# EasyEDA schematic RFFI_pwrCtrl_Integrated_2021-05-07.json

## Sheets
1 Analog Signals: TITLE: Аналоговые сигналы; REV: 1.0; Date: 2021-04-26; Sheet: 1/1; Drawn By: Kirill Ivanychev; Company: NNTU
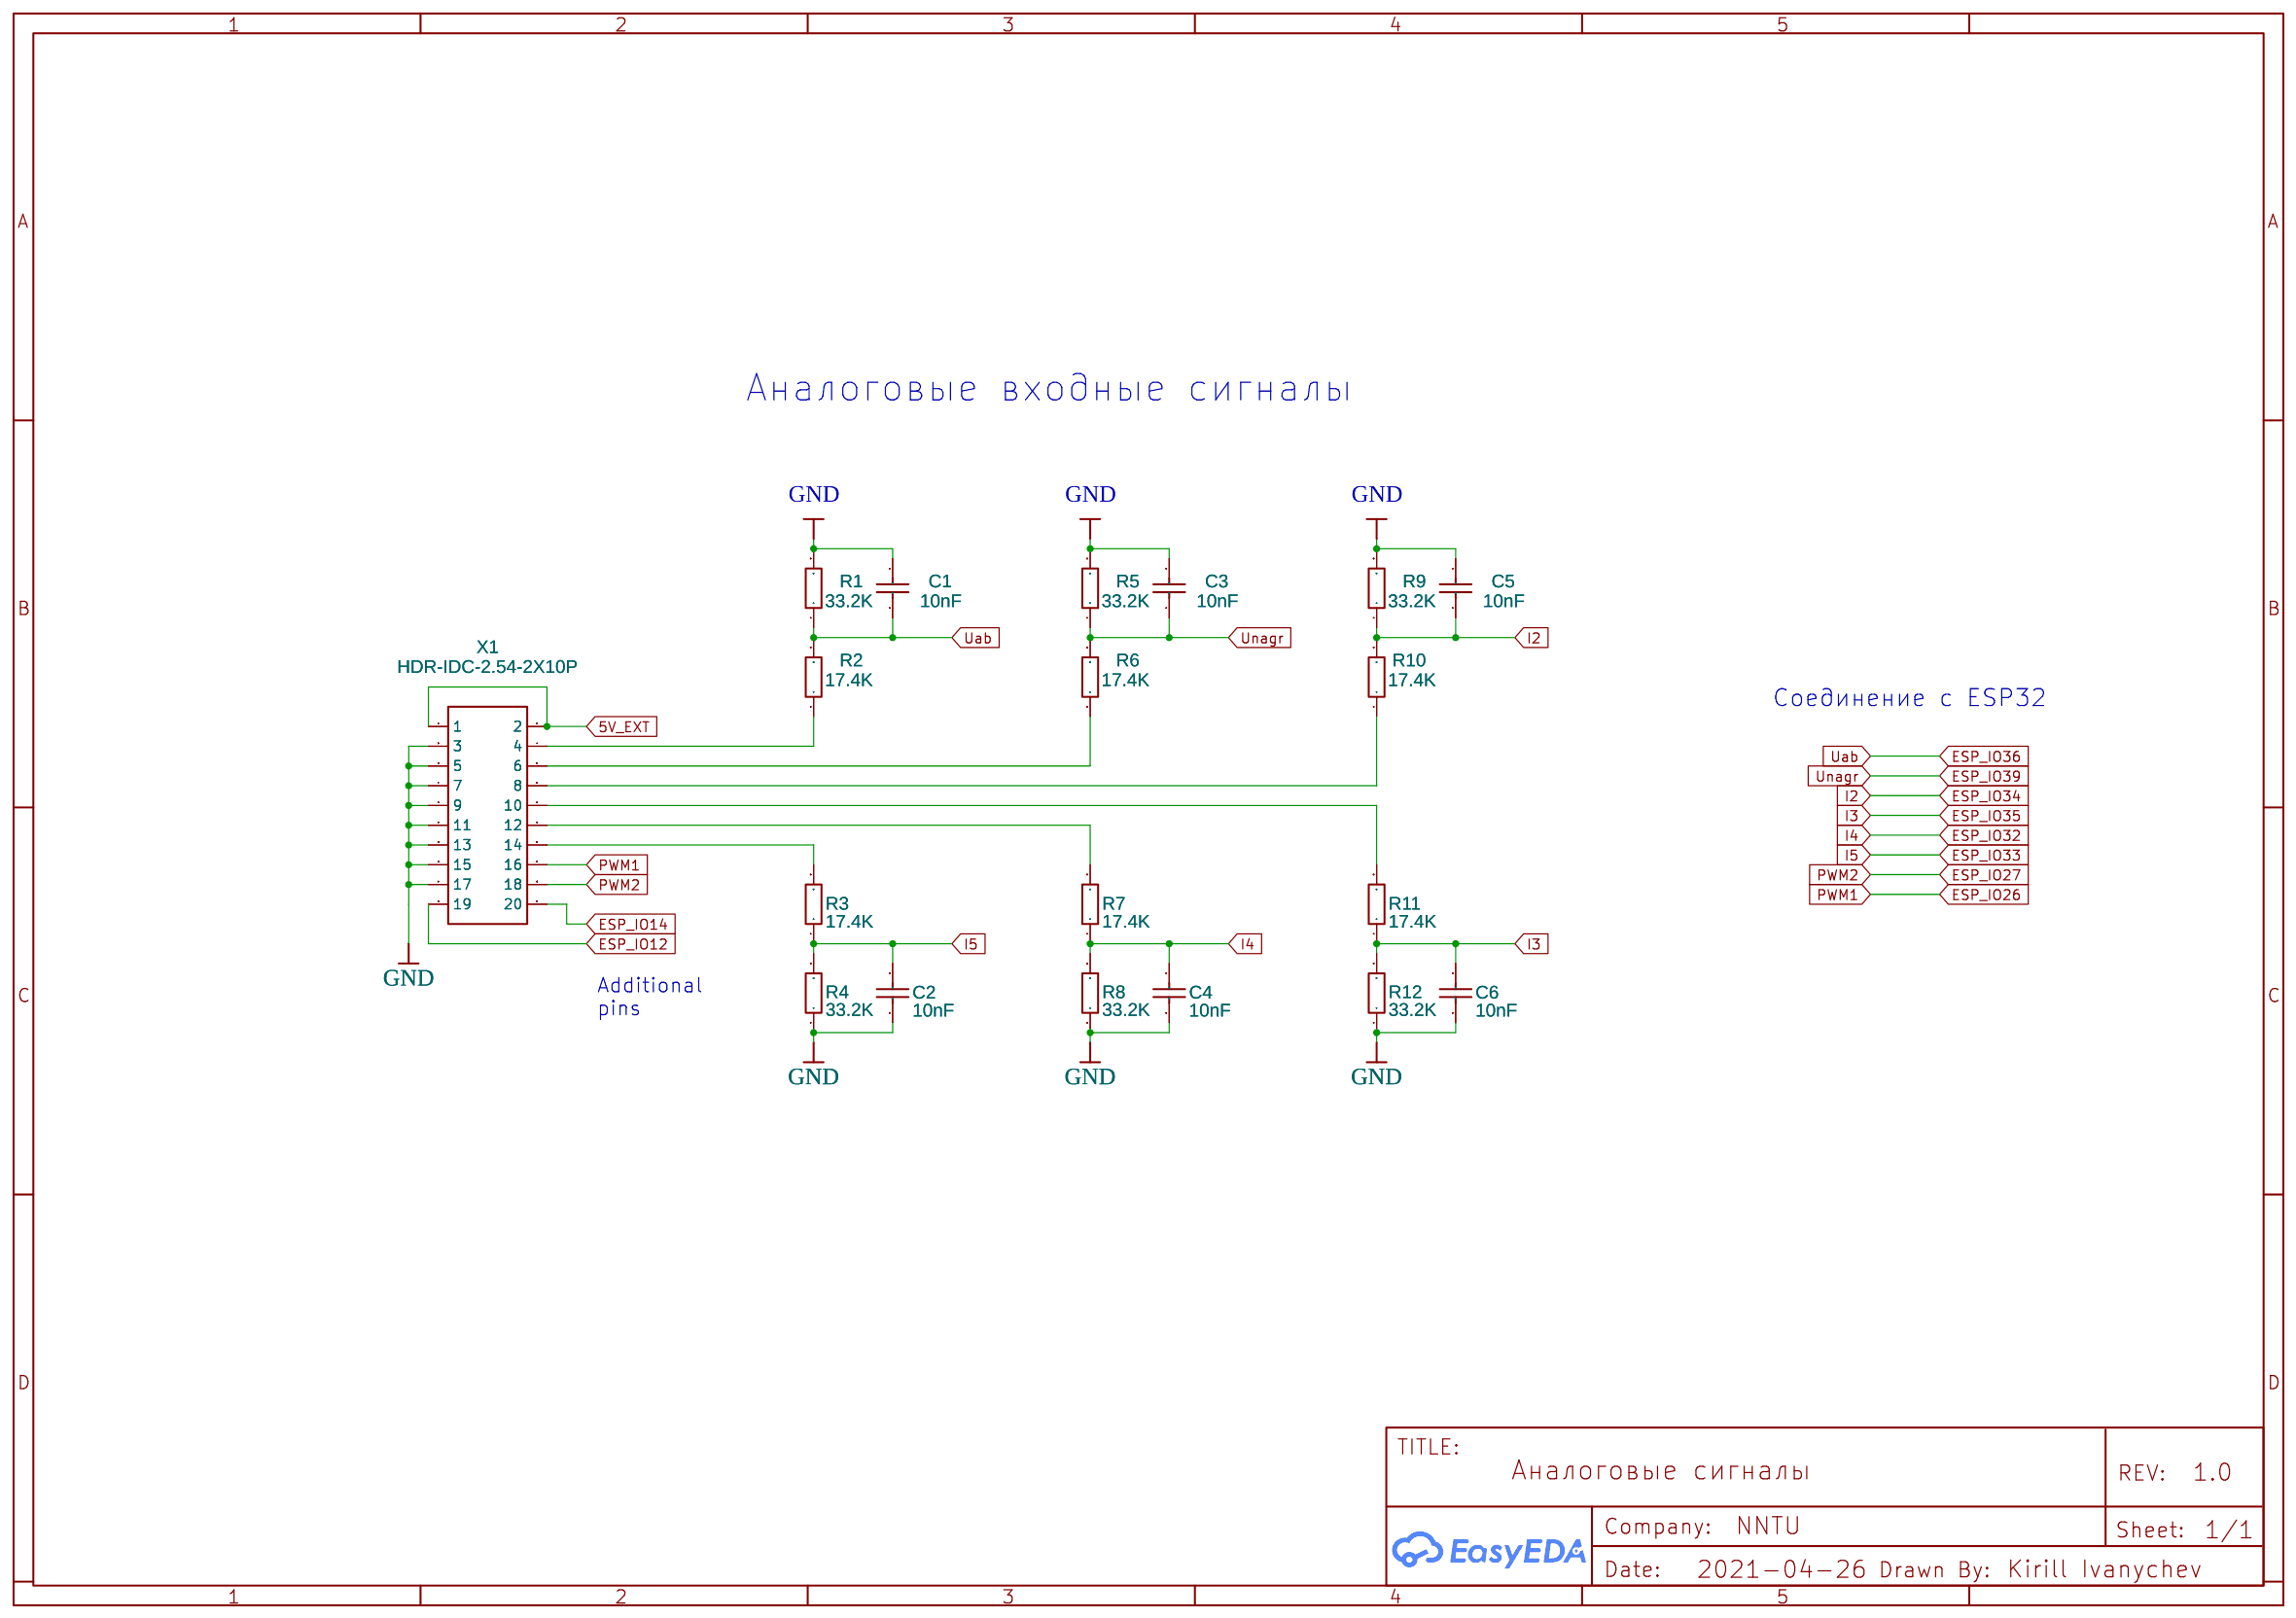
[diagram p0: Analog Signals]
2 ESP32 module: TITLE: ESP32 module; Date: 2021-05-07
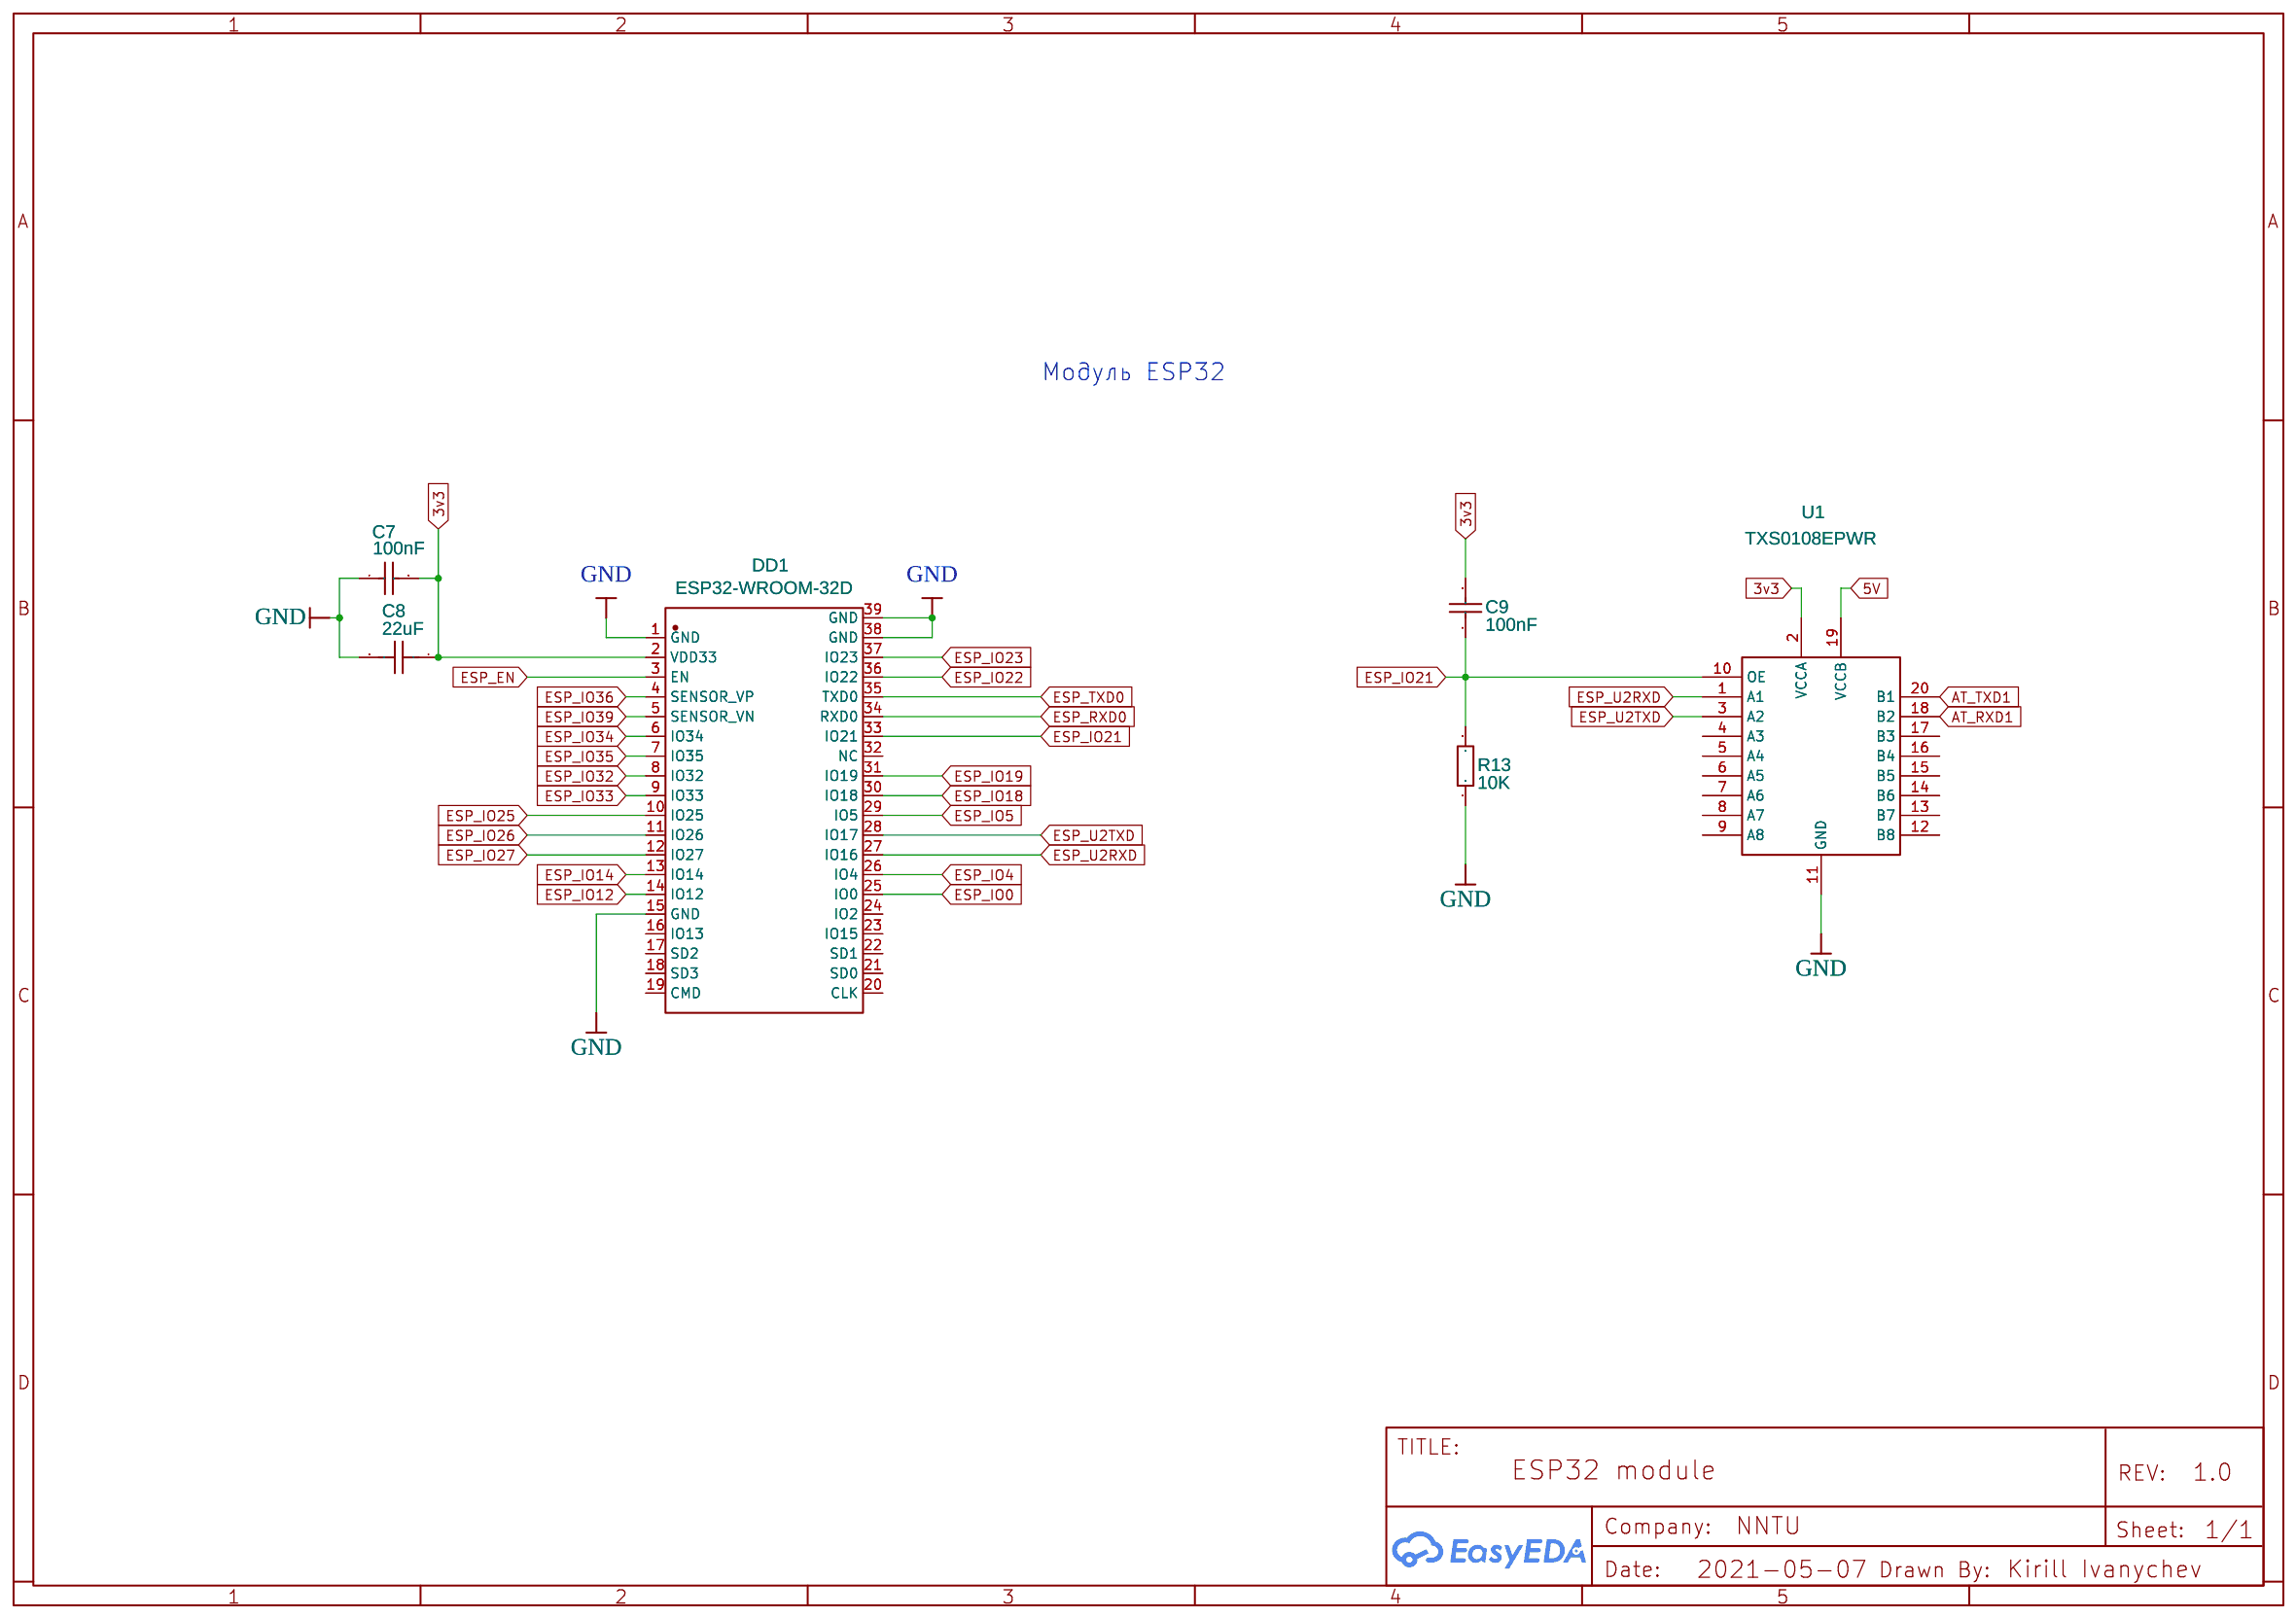
[diagram p1: ESP32 module]
3 USB: TITLE: USB; Date: 2021-04-14
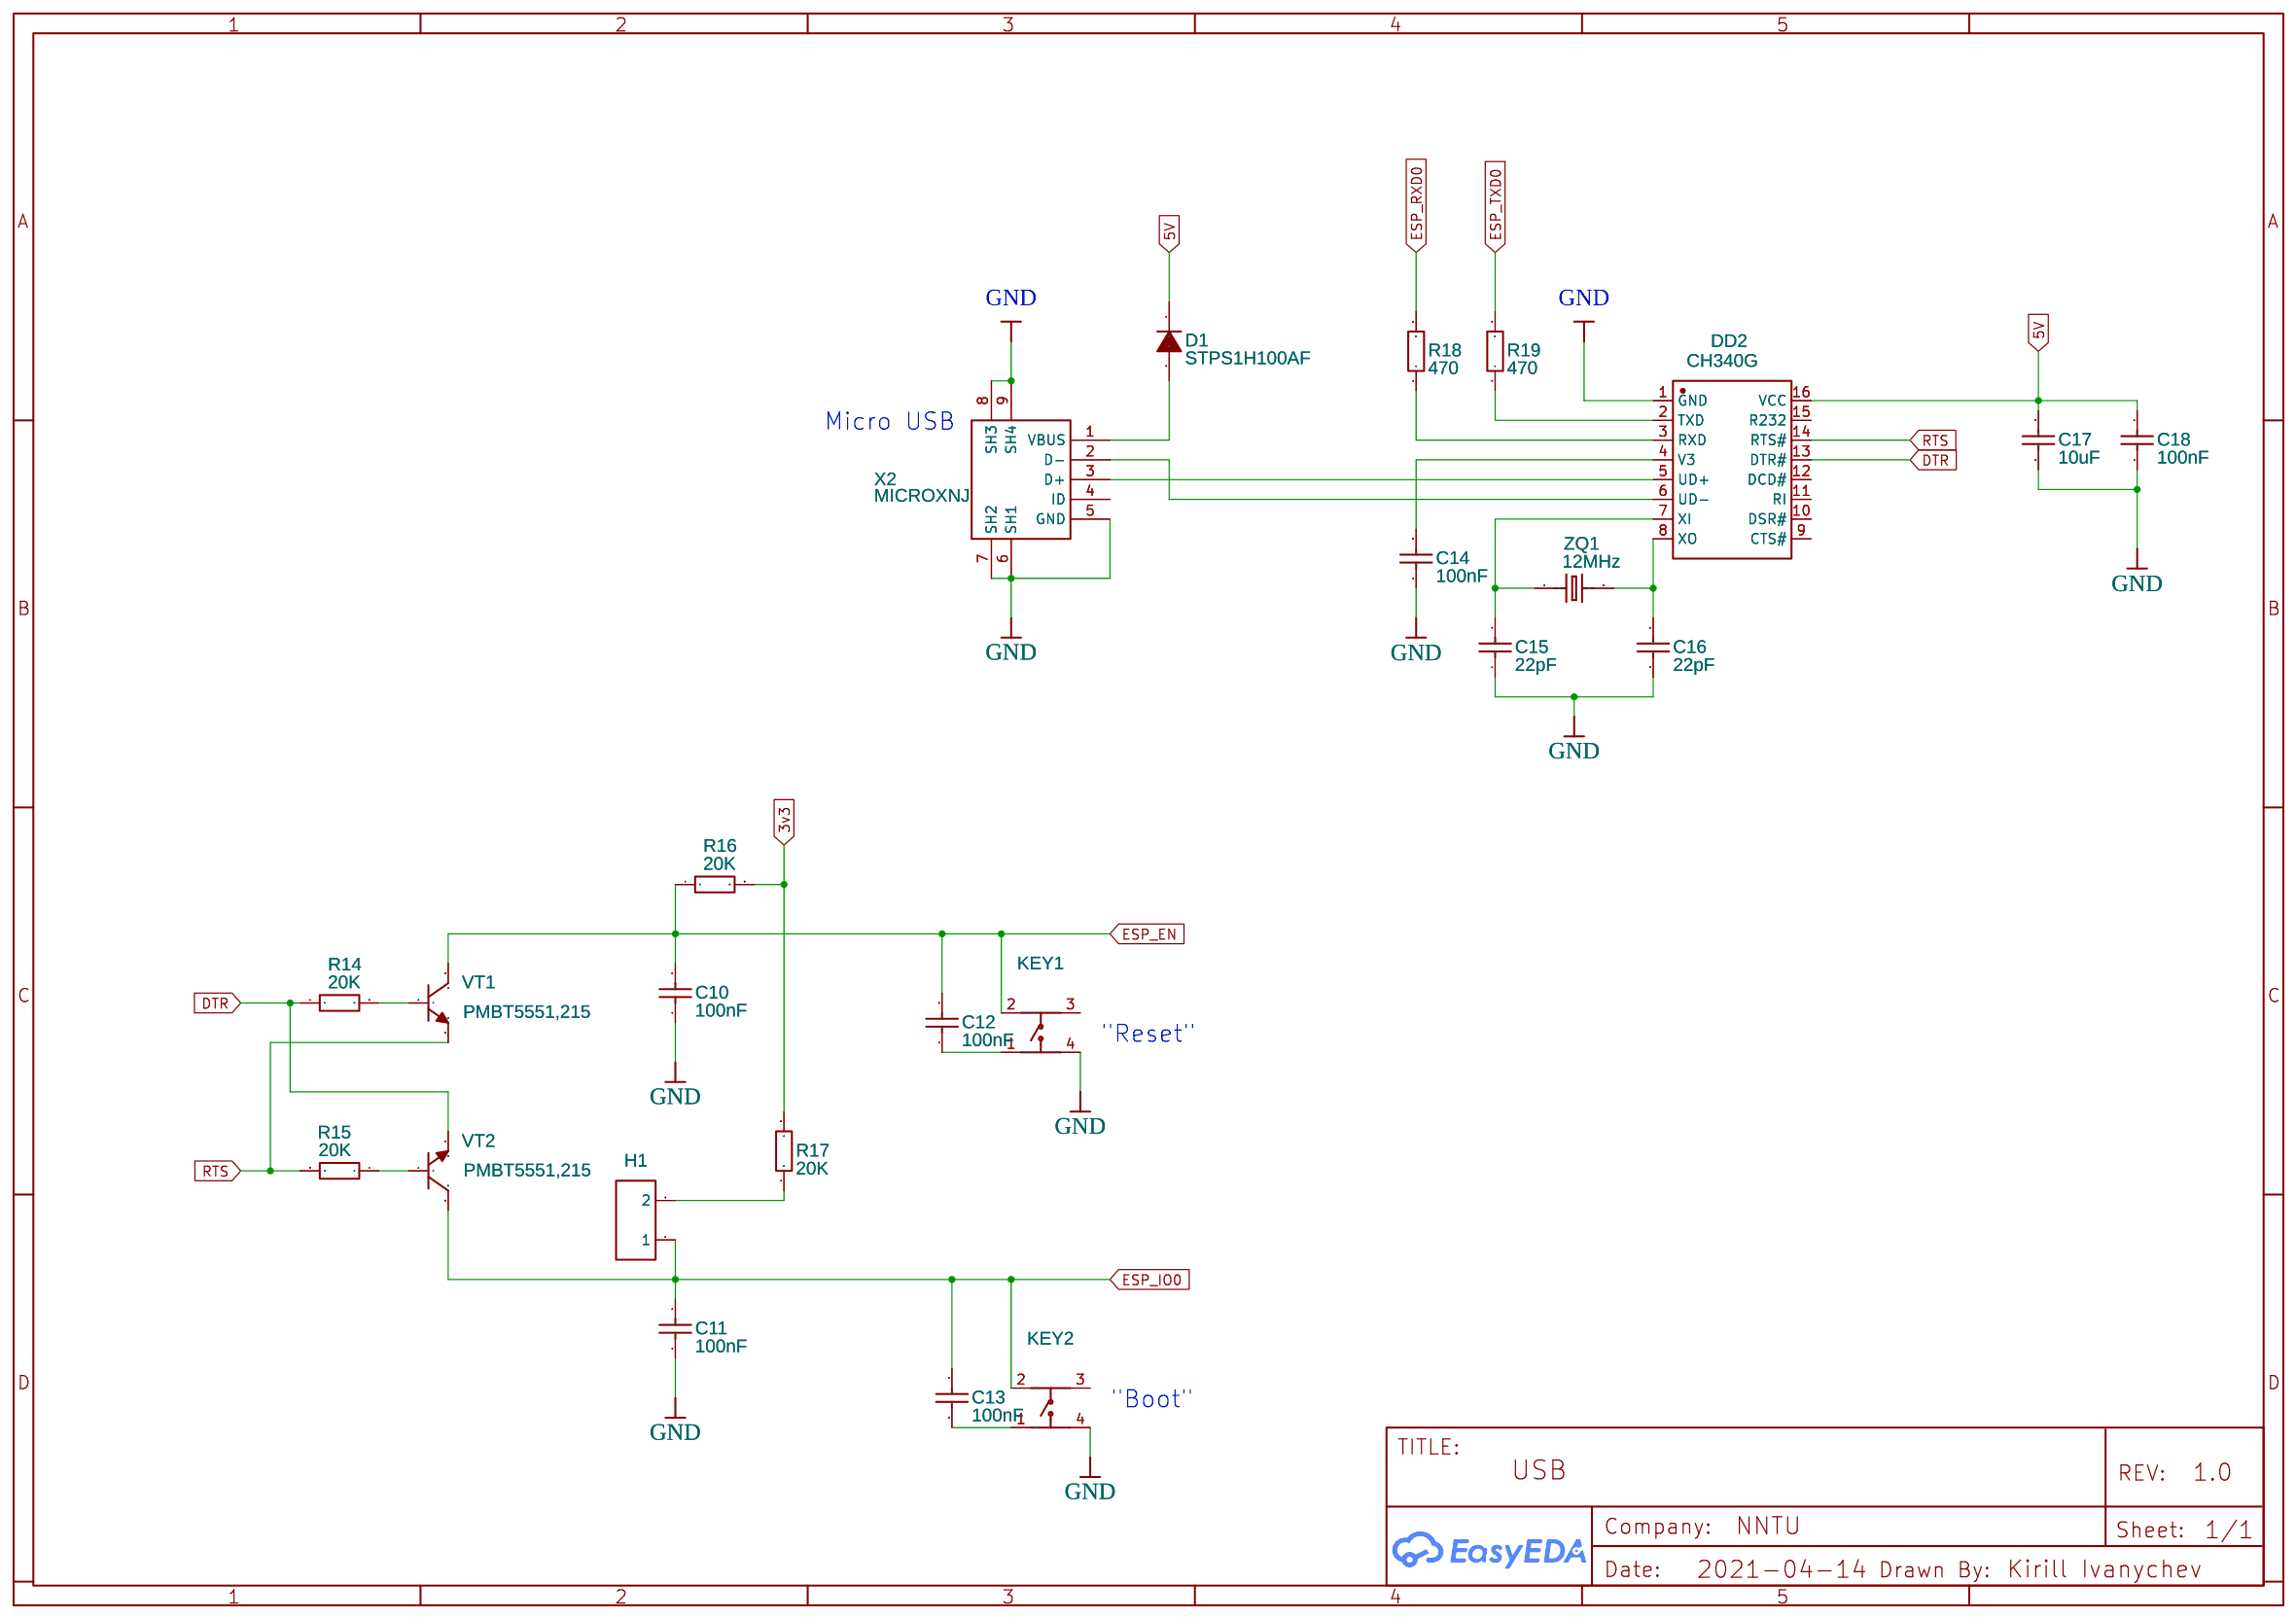
[diagram p2: USB]
4 Power: TITLE: Питание; Date: 2021-04-23
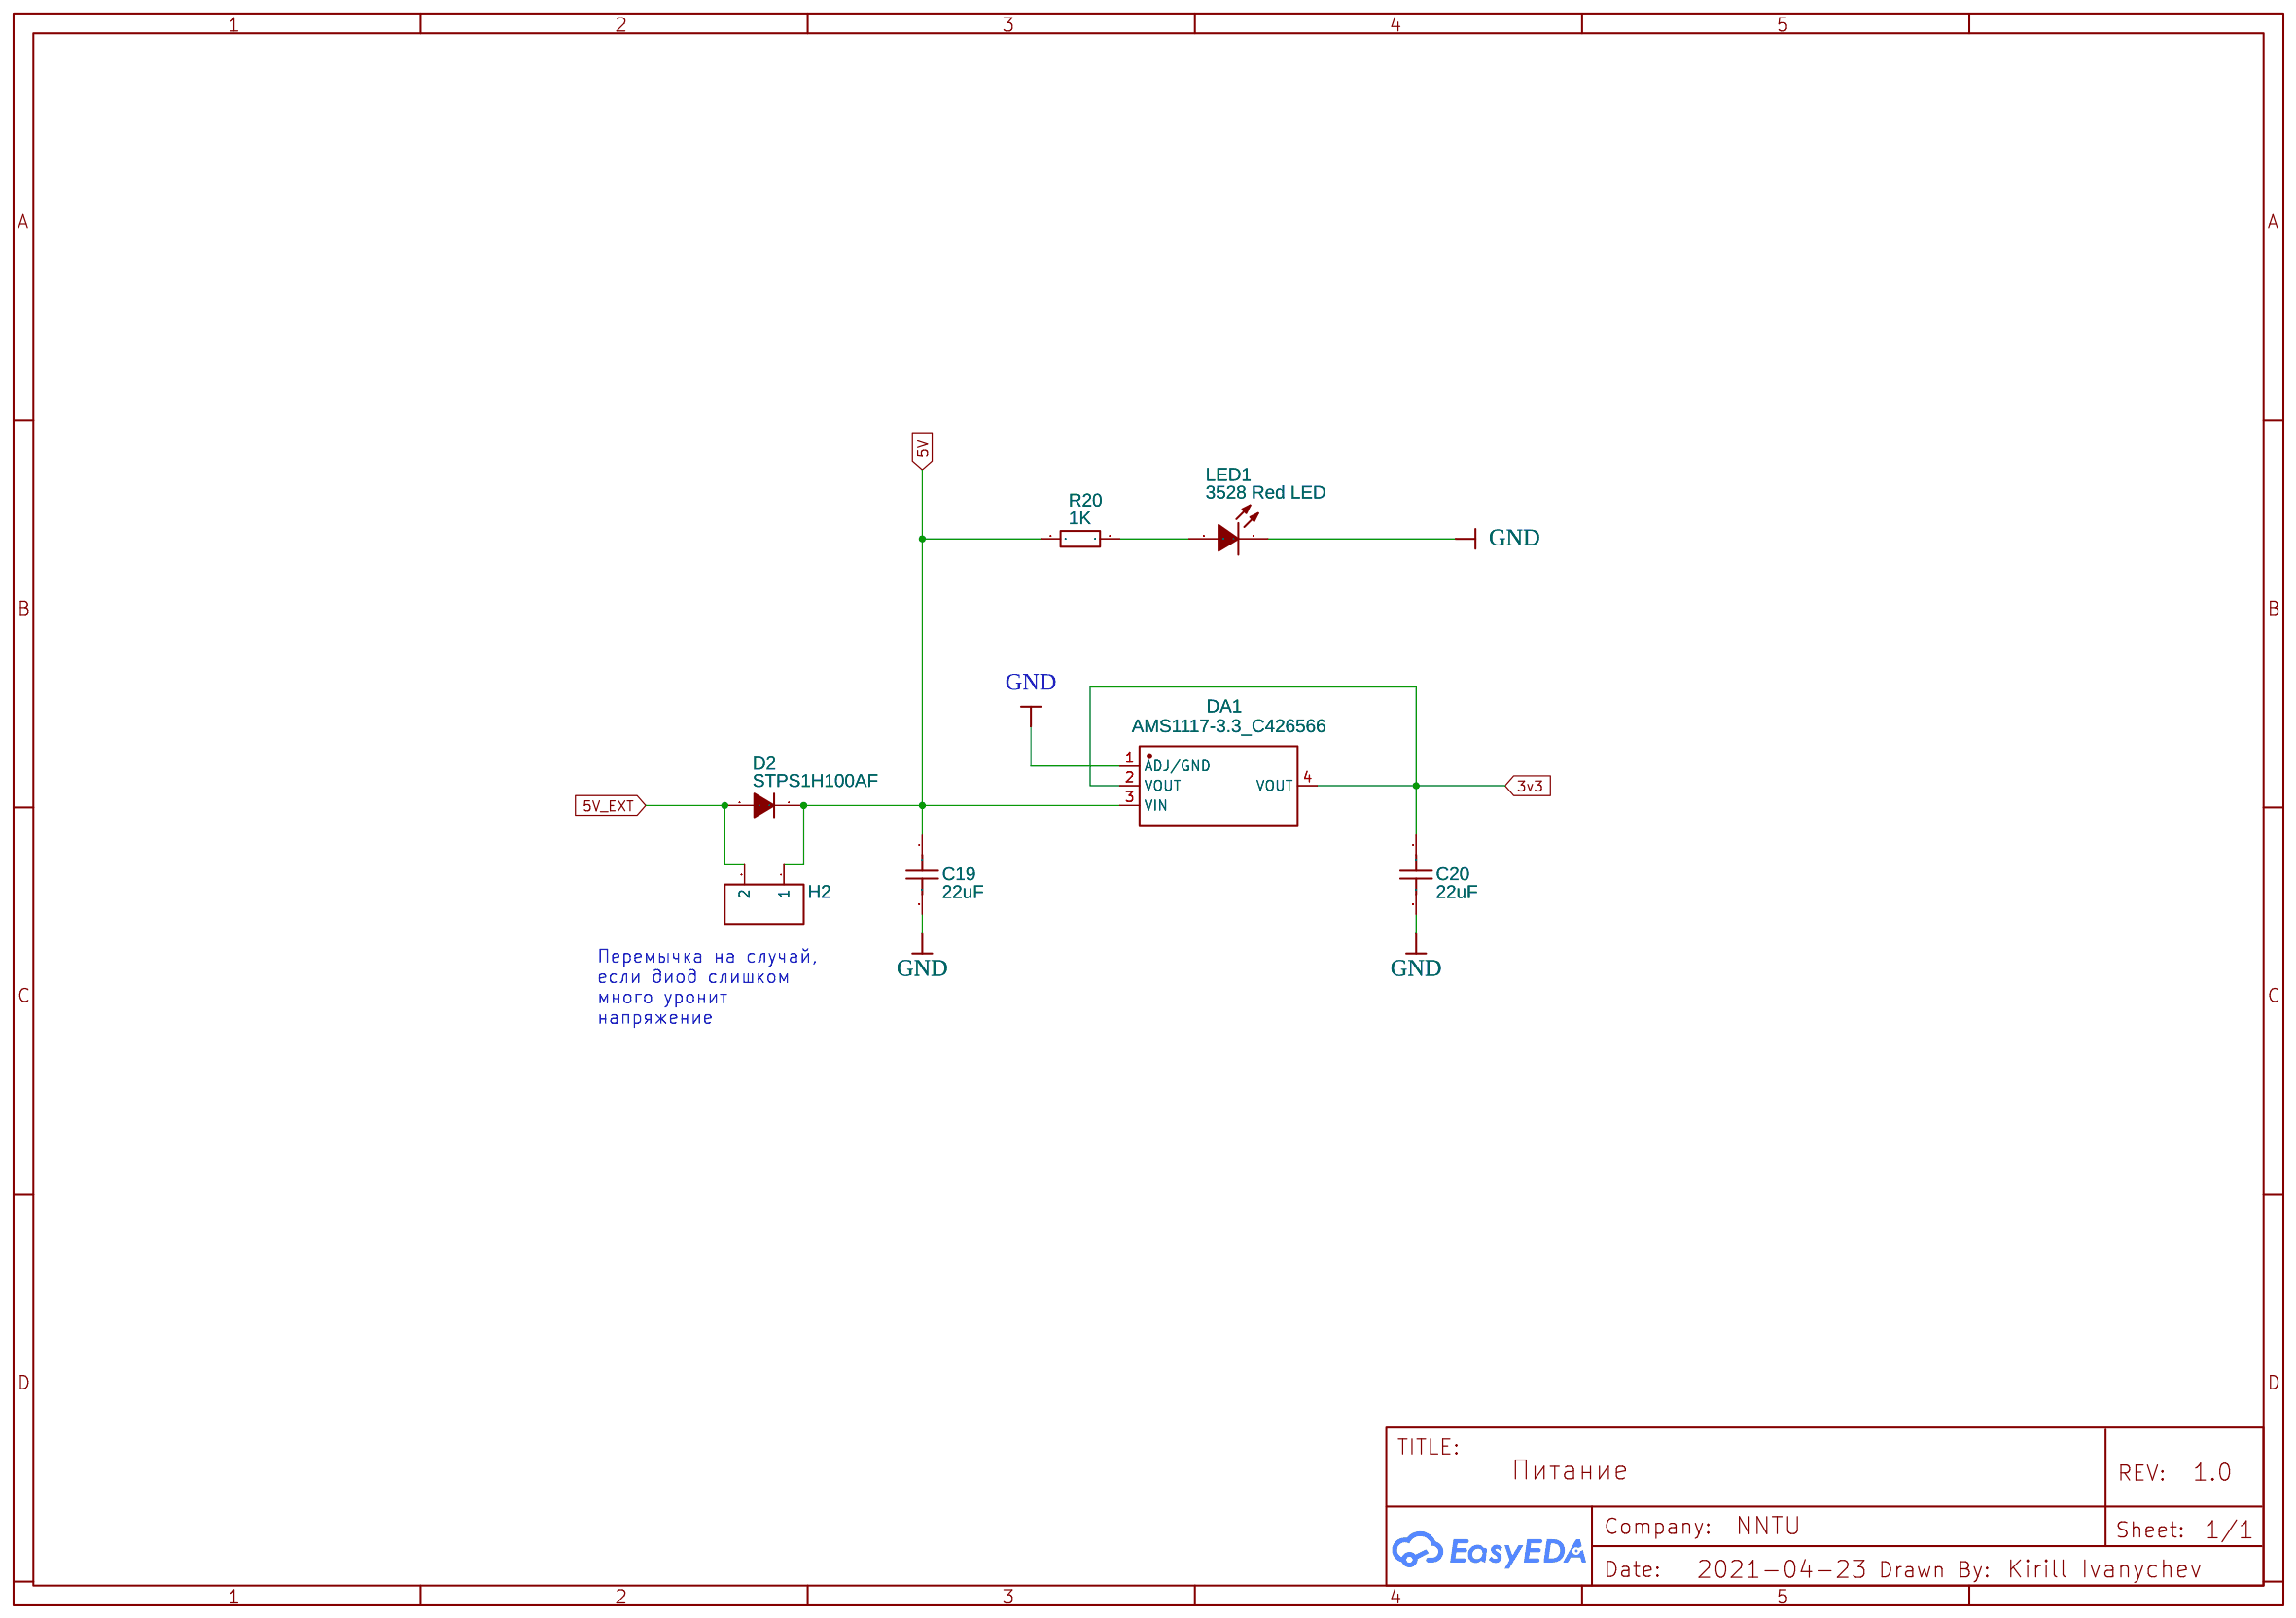
[diagram p3: Power]
5 Batteries: TITLE: Состояние батарей; Date: 2021-04-15
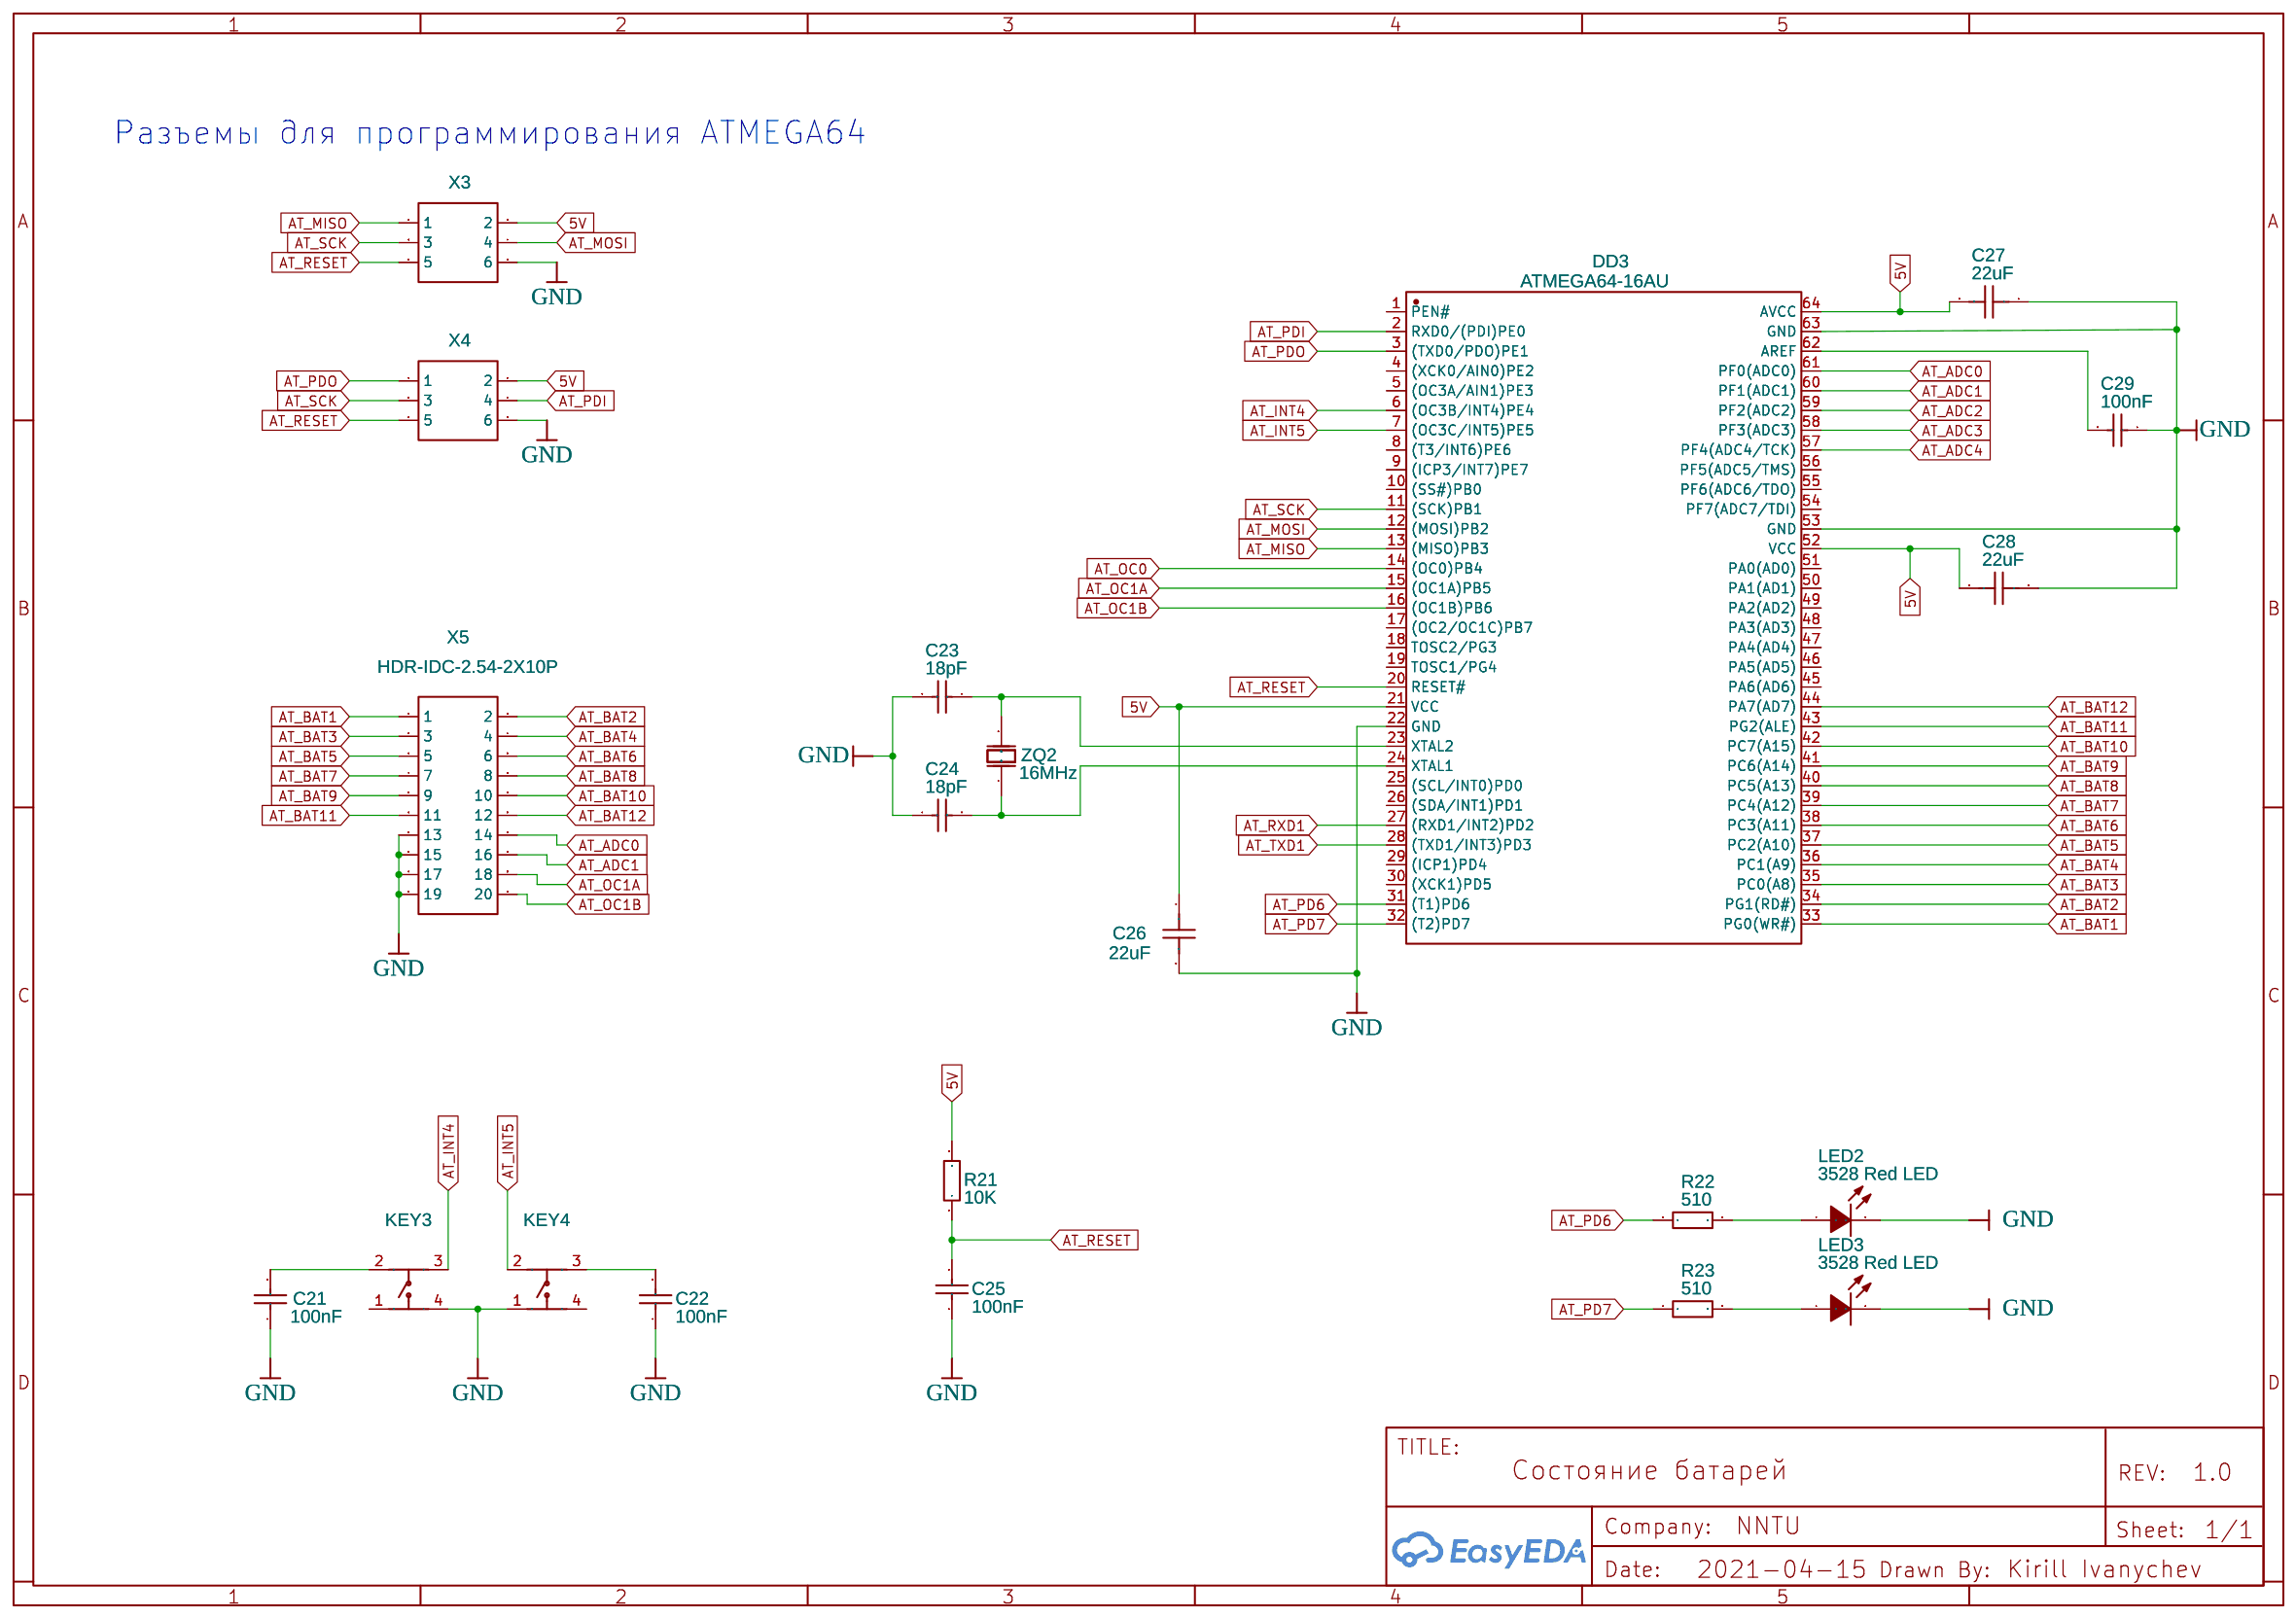
[diagram p4: Batteries]
6 Ethernet: TITLE: Ethernet; Date: 2021-04-23
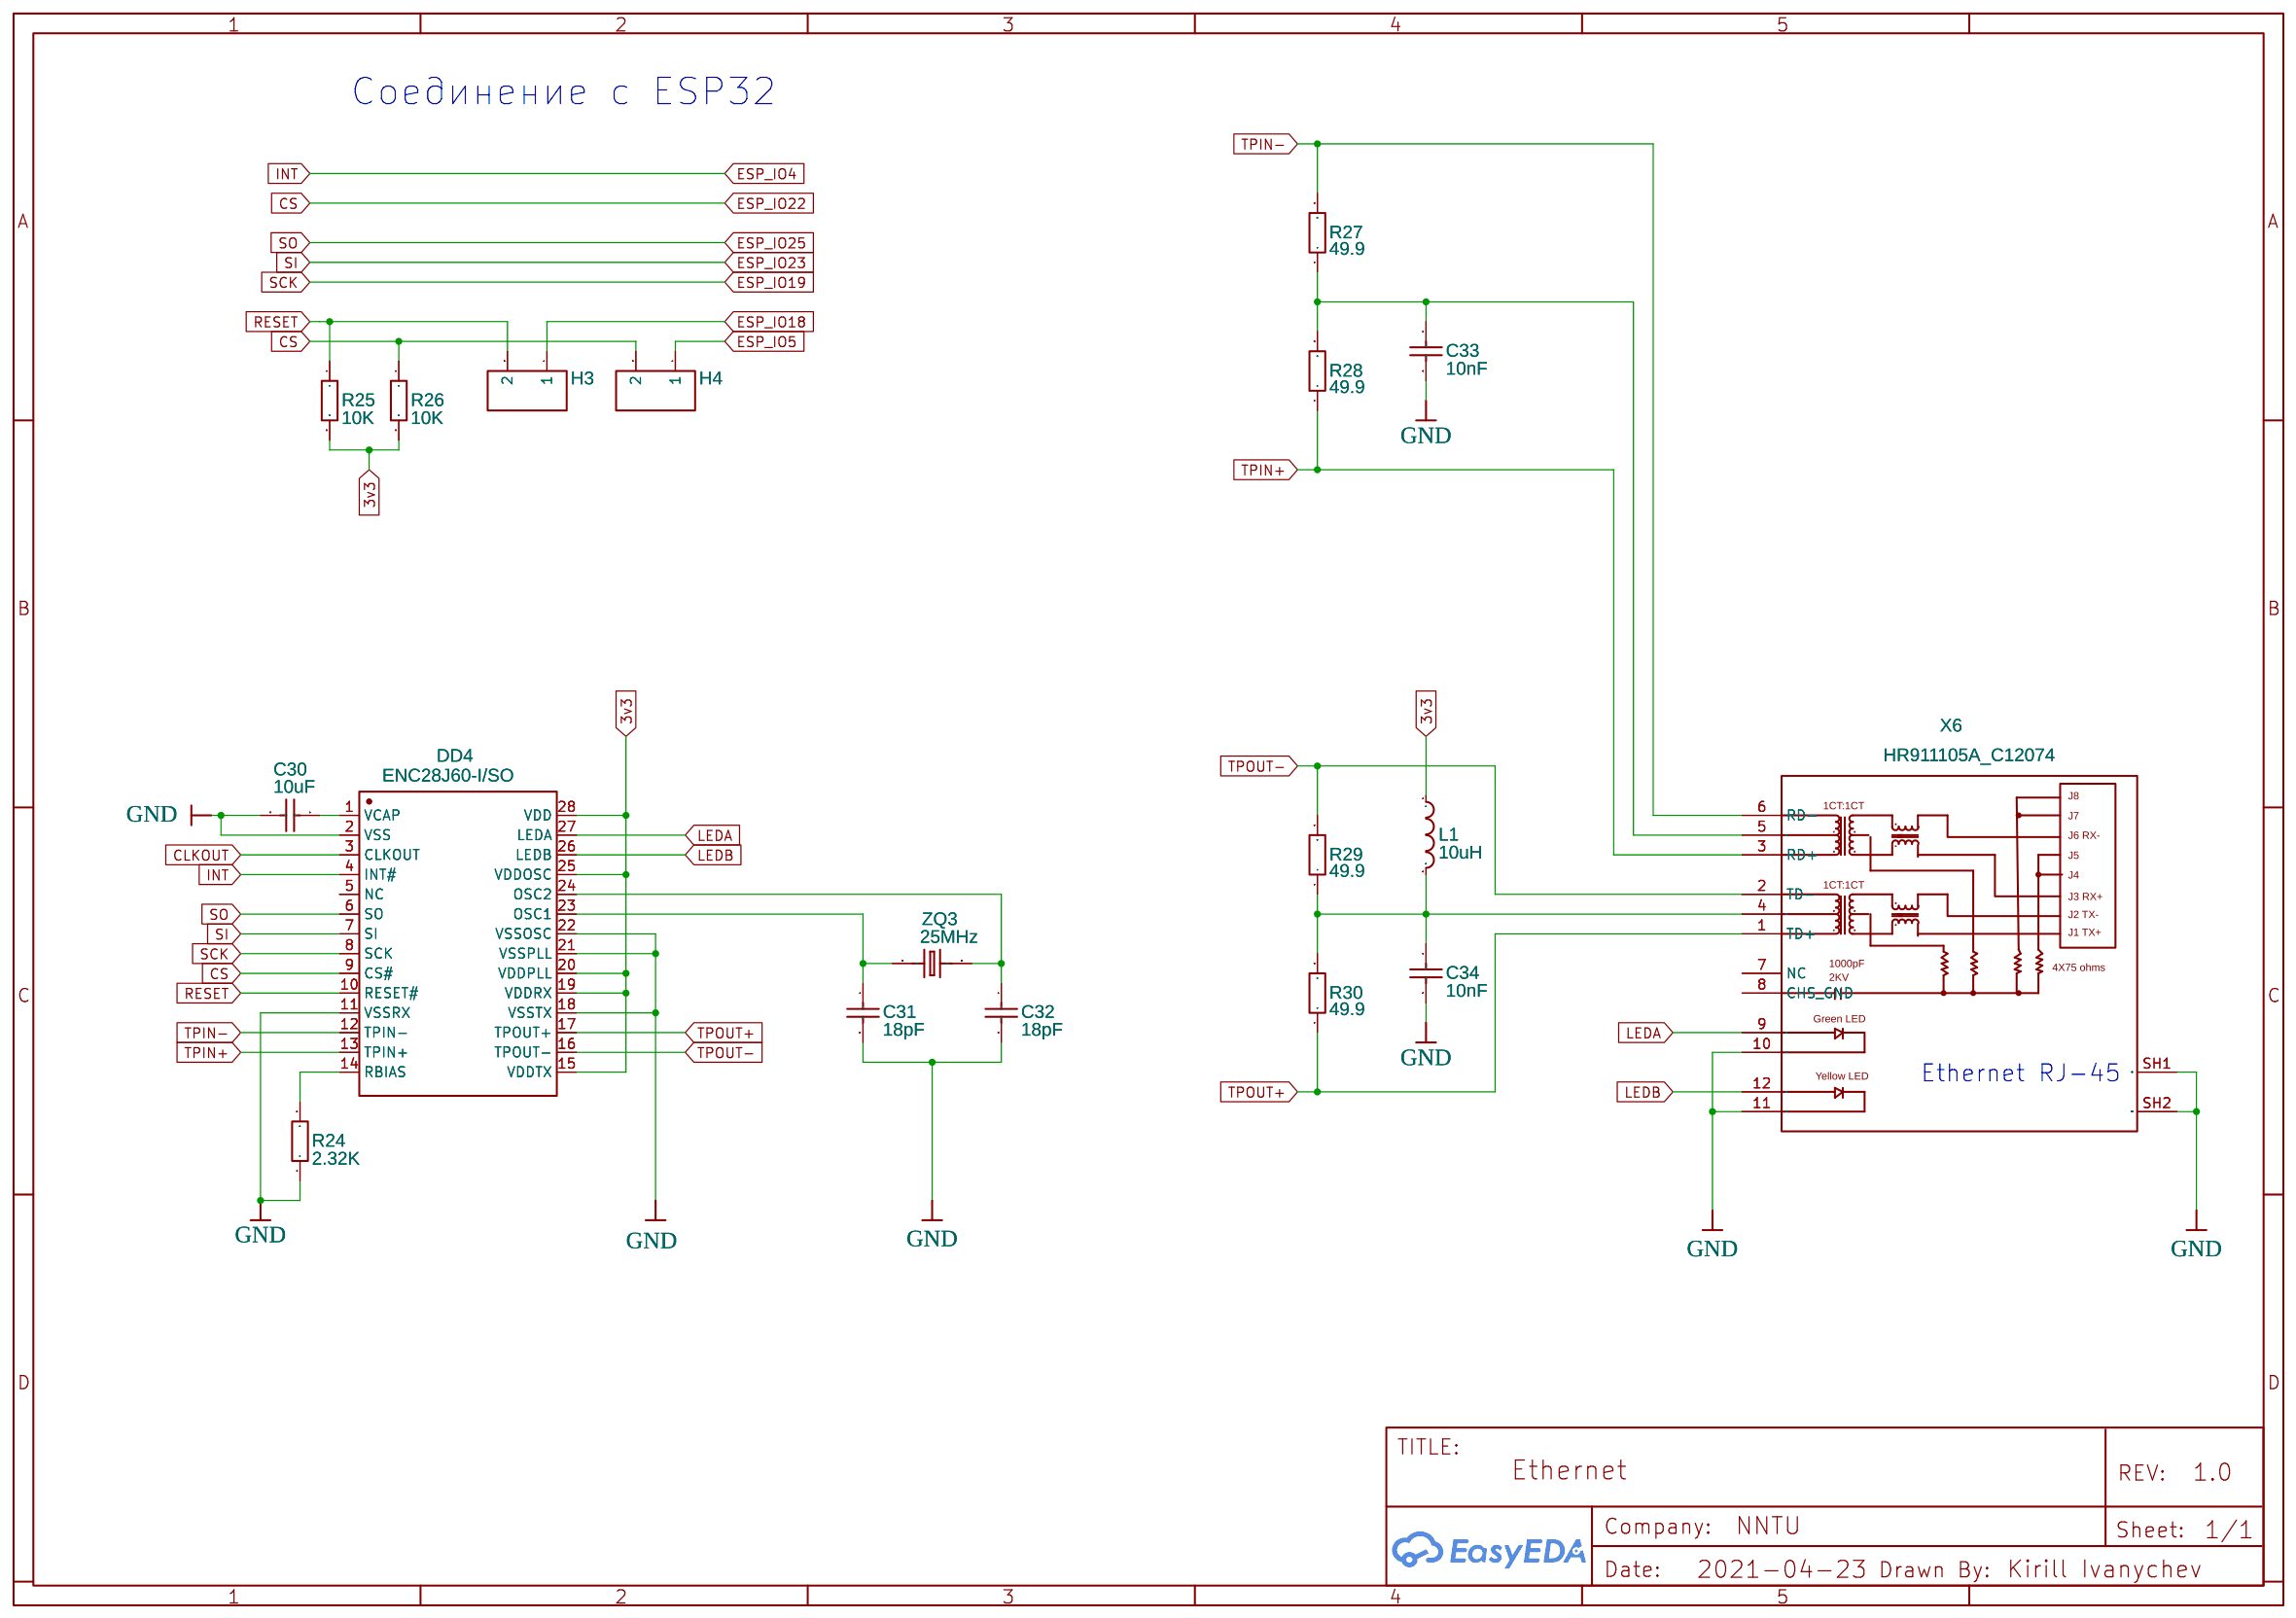
[diagram p5: Ethernet]

## Parts
sheet Analog Signals
C1  10nF  [C1206]
C2  10nF  [C1206]
C3  10nF  [C1206]
C4  10nF  [C1206]
C5  10nF  [C1206]
C6  10nF  [C1206]
R1  33.2K  [R0603]
R2  17.4K  [R0402]
R3  17.4K  [R0402]
R4  33.2K  [R0603]
R5  33.2K  [R0603]
R6  17.4K  [R0402]
R7  17.4K  [R0402]
R8  33.2K  [R0603]
R9  33.2K  [R0603]
R10  17.4K  [R0402]
R11  17.4K  [R0402]
R12  33.2K  [R0603]
X1  HDR-IDC-2.54-2X10P  [IDC-TH_20P-P2.54-V-R2-C10-S2.54]
sheet Batteries
C21  100nF  [C0805]
C22  100nF  [C0805]
C23  18pF  [C0402]
C24  18pF  [C0402]
C25  100nF  [C0805]
C26  22uF  [C0805]
C27  22uF  [C0805]
C28  22uF  [C0805]
C29  100nF  [C0805]
DD3  ATMEGA64-16AU  [TQFP-64_L14.0-W14.0-P0.80-LS14.0-BL]
KEY3  TSA063G50-250  [KEY-SMD_4P-L6.0-W6.0-P4.50-LS10.0]
KEY4  TSA063G50-250  [KEY-SMD_4P-L6.0-W6.0-P4.50-LS10.0]
LED2  3528 Red LED  [LED-SMD_L3.5-W2.8-R-RD]
LED3  3528 Red LED  [LED-SMD_L3.5-W2.8-R-RD]
R21  10K  [R0603]
R22  510  [R1206]
R23  510  [R1206]
X3  Header-Male-2.54_2x3  [HDR-TH_6P-P2.54-V-R2-C3-S2.54]
X4  Header-Male-2.54_2x3  [HDR-TH_6P-P2.54-V-R2-C3-S2.54]
X5  HDR-IDC-2.54-2X10P  [IDC-TH_20P-P2.54-V-R2-C10-S2.54]
ZQ2  16MHz  [HC-49US_L11.5-W4.5-P4.88]
sheet ESP32 module
C7  100nF  [C0805]
C8  22uF  [C0805]
C9  100nF  [C0805]
DD1  ESP32-WROOM-32D  [WIFIM-SMD_39P-L25.5-W18.0-P1.27-BL]
R13  10K  [R0603]
U1  TXS0108EPWR  [TSSOP-20_L6.5-W4.4-P0.65-LS6.4-BL]
sheet Ethernet
C30  10uF  [C1206]
C31  18pF  [C0402]
C32  18pF  [C0402]
C33  10nF  [C0805]
C34  10nF  [C0805]
DD4  ENC28J60-I/SO  [SOIC-28_L17.9-W7.5-P1.27-LS10.3-BL]
H3  Header-Male-2.54_1x2  [HDR-TH_2P-P2.54-V]
H4  Header-Male-2.54_1x2  [HDR-TH_2P-P2.54-V]
L1  10uH  [L1206]
R24  2.32K  [R1206]
R25  10K  [R0603]
R26  10K  [R0603]
R27  49.9  [R0805]
R28  49.9  [R0805]
R29  49.9  [R0805]
R30  49.9  [R0805]
X6  HR911105A_C12074  [RJ45-TH_HR911105A]
ZQ3  25MHz  [HC-49US_L11.5-W4.5-P4.88]
sheet Power
C19  22uF  [C0805]
C20  22uF  [C0805]
D2  STPS1H100AF  [SMA_L4.3-W2.6-LS5.2-RD]
DA1  AMS1117-3.3_C426566  [SOT-223_L6.5-W3.5-P2.30-LS7.0-BR]
H2  Header-Male-2.54_1x2  [HDR-TH_2P-P2.54-V]
LED1  3528 Red LED  [LED-SMD_L3.5-W2.8-R-RD]
R20  1K  [R0805]
sheet USB
C10  100nF  [C0805]
C11  100nF  [C0805]
C12  100nF  [C0805]
C13  100nF  [C0805]
C14  100nF  [C0805]
C15  22pF  [C0603]
C16  22pF  [C0603]
C17  10uF  [C1206]
C18  100nF  [C0805]
D1  STPS1H100AF  [SMA_L4.3-W2.6-LS5.2-RD]
DD2  CH340G  [SOIC-16_L9.9-W3.9-P1.27-LS6.0-TL]
H1  Header-Male-2.54_1x2  [HDR-TH_2P-P2.54-V]
KEY1  TSA063G50-250  [KEY-SMD_4P-L6.0-W6.0-P4.50-LS10.0]
KEY2  TSA063G50-250  [KEY-SMD_4P-L6.0-W6.0-P4.50-LS10.0]
R14  20K  [R0805]
R15  20K  [R0805]
R16  20K  [R0805]
R17  20K  [R0805]
R18  470  [R1206]
R19  470  [R1206]
VT1  PMBT5551,215  [SOT-23_L2.9-W1.3-P1.90-LS2.4-BR]
VT2  PMBT5551,215  [SOT-23_L2.9-W1.3-P1.90-LS2.4-BR]
X2  MICROXNJ  [MICRO-USB-SMD_MICROXNJ]
ZQ1  12MHz  [HC-49US_L11.5-W4.5-P4.88]

## Library data of the parts
C1-C6 = 1206B103K500NT: Supplier: LCSC; Manufacturer: FH; Supplier Part: C1846; SMT Type: Basic; JLCPCB SMD: Yes; LCSC Assembly: Yes; Paste Type: base
R1 R4 R5 R8 R9 R12 = 0603WAF3322T5E: Supplier: LCSC; Manufacturer: UniOhm; Supplier Part: C23003; SMT Type: Extend; JLCPCB SMD: Yes; LCSC Assembly: Yes; Paste Type: expand
R2 R3 R6 R7 R10 R11 = 0402WGF1742TCE: Supplier: LCSC; Manufacturer: UniOhm; Supplier Part: C26957; SMT Type: Extend; JLCPCB SMD: Yes; LCSC Assembly: Yes; Paste Type: expand
X1 X5 = HDR-IDC-2.54-2X10P: Supplier: LCSC; Manufacturer: BOOMELE; Manufacturer Part: IDC Box 2.54mm 2X10P　Straight; image: //image.lceda.cn/szlcsc/C3405.jpg; Supplier Part: C3405; LCSC Assembly: Yes; SMT Type: Extend; Paste Type: expand
C7 C9-C14 C18 C21 C22 C25 C29 = CL21B104JBCNNNC: Supplier: LCSC; Manufacturer: SAMSUNG; Supplier Part: C62912; SMT Type: Extend; JLCPCB SMD: Yes; LCSC Assembly: Yes; Paste Type: expand
C23 C24 C31 C32 = 0402CG180J500NT: Supplier: LCSC; Manufacturer: FH; Supplier Part: C1549; SMT Type: Basic; JLCPCB SMD: Yes; LCSC Assembly: Yes; Paste Type: base
C8 C19 C20 C26-C28 = CL21A226MQQNNNE: Supplier: LCSC; Manufacturer: SAMSUNG; Supplier Part: C5674; LCSC Assembly: Yes; SMT Type: Extend; Paste Type: expand
DD3 = ATMEGA64-16AU: Supplier: LCSC; Supplier Part: C219170; Manufacturer: Microchip Tech; Contributor: LCSC; SMT Type: Extend; JLCPCB SMD: Yes; LCSC Assembly: Yes; Paste Type: expand
KEY1-KEY4 = TSA063G50-250: Supplier: LCSC; Supplier Part: C294565; Manufacturer: BRIGHT; Contributor: LCSC; Paste Type: expand
LED1-LED3 = 3528 Red LED: Supplier: LCSC; Manufacturer: KENTO; image: //image.lceda.cn/szlcsc/C2305.jpg; Supplier Part: C2305; SMT Type: Extend; JLCPCB SMD: Yes; Paste Type: recommend
R13 R21 R25 R26 = ARG03FTC1002: Supplier: LCSC; Supplier Part: C217687; Manufacturer: Viking Tech; Contributor: LCSC; Paste Type: expand
R22 R23 = 1206W4J0511T5E: Supplier: LCSC; Manufacturer: UniOhm; Supplier Part: C25386; Paste Type: expand
X3 X4 = Header-Male-2.54_2x3: Supplier: LCSC; Manufacturer: BOOMELE; Supplier Part: C65114; LCSC Assembly: Yes; SMT Type: Extend; Paste Type: expand
ZQ2 = X49SD16MSB2SI: Supplier: LCSC; Supplier Part: C188202; Manufacturer: Yangxing Tech; Contributor: LCSC; LCSC Assembly: Yes; SMT Type: Extend; Paste Type: expand
DD1 = ESP32-WROOM-32D: Supplier: LCSC; Supplier Part: C473012; Manufacturer: ESPRESSIF 乐鑫; Contributor: LCSC; Paste Type: expand
U1 = TXS0108EPWR: Supplier: LCSC; Manufacturer: TI; image: //image.lceda.cn/szlcsc/C17206.jpg; Supplier Part: C17206; SMT Type: Extend; JLCPCB SMD: Yes; Paste Type: recommend
C17 C30 = CL31B106KOHNNNE: Supplier: LCSC; Manufacturer: SAMSUNG; Supplier Part: C47971; LCSC Assembly: Yes; SMT Type: Extend; Paste Type: expand
C33 C34 = CL21B103KBANNNC: Supplier: LCSC; Manufacturer: SAMSUNG; Supplier Part: C1710; SMT Type: Basic; JLCPCB SMD: Yes; LCSC Assembly: Yes; Paste Type: base
DD4 = ENC28J60-I/SO: Supplier: LCSC; Manufacturer: MICROCHIP; Supplier Part: C47351; SMT Type: Extend; JLCPCB SMD: Yes; LCSC Assembly: Yes; Paste Type: expand
H1-H4 = Header-Male-2.54_1x2: Supplier: LCSC; Manufacturer: TE Connectivity; Manufacturer Part: 826629-2; image: //image.lceda.cn/szlcsc/C86471.jpg; Supplier Part: C86471; LCSC Assembly: Yes; SMT Type: Extend; Paste Type: expand
L1 = CMI321609X100KT: Supplier: LCSC; Manufacturer: FH; Supplier Part: C1051; SMT Type: Basic; JLCPCB SMD: Yes; LCSC Assembly: Yes; Paste Type: base
R24 = 1206W4F2321T5E: Supplier: LCSC; Supplier Part: C247348; Manufacturer: Uniroyal Elec; Contributor: LCSC; SMT Type: Extend; JLCPCB SMD: Yes; LCSC Assembly: Yes; Paste Type: expand
R27-R30 = 0805W8F499JT5E: Supplier: LCSC; Manufacturer: UniOhm; Supplier Part: C17720; SMT Type: Basic; JLCPCB SMD: Yes; LCSC Assembly: Yes; Paste Type: base
X6 = HR911105A_C12074: Supplier: LCSC; Manufacturer: HANRUN; Manufacturer Part: HR911105A; image: //image.lceda.cn/szlcsc/C12074.jpg; Supplier Part: C12074; Paste Type: expand
ZQ3 = X49SD25MSD2SI: Supplier: LCSC; Manufacturer: ValuePro; Contributor: LCSC; Supplier Part: C130152; LCSC Assembly: Yes; SMT Type: Extend; Paste Type: expand
D1 D2 = STPS1H100AF: Supplier: LCSC; Supplier Part: C361044; Manufacturer: STMicroelectronics; Contributor: LCSC; Paste Type: 1
DA1 = AMS1117-3.3_C426566: Supplier: LCSC; Supplier Part: C426566; Manufacturer: SLKORMICRO Elec.; Manufacturer Part: AMS1117-3.3; Contributor: LCSC; LCSC Assembly: Yes; SMT Type: Extend; Paste Type: expand
R20 = TC0525F1001T5E: Supplier: LCSC; Manufacturer: UniOhm; Supplier Part: C75781; SMT Type: Extend; JLCPCB SMD: Yes; LCSC Assembly: Yes; Paste Type: expand
C15 C16 = CL10C220JB8NNNC: Supplier: LCSC; Manufacturer: SAMSUNG; Supplier Part: C1653; SMT Type: Basic; JLCPCB SMD: Yes; LCSC Assembly: Yes; Paste Type: base
DD2 = CH340G: Supplier: LCSC; Manufacturer: WCH; image: //image.lceda.cn/szlcsc/C14267.jpg; Supplier Part: C14267; SMT Type: Basic; JLCPCB SMD: Yes; Paste Type: base
R14-R17 = 0805W8F2002T5E: Supplier: LCSC; Manufacturer: UniOhm; Supplier Part: C4328; SMT Type: Basic; JLCPCB SMD: Yes; LCSC Assembly: Yes; Paste Type: base
R18 R19 = 1206W4J0471T5E: Supplier: LCSC; Manufacturer: UniOhm; Supplier Part: C25383; SMT Type: Extend; JLCPCB SMD: Yes; LCSC Assembly: Yes; Paste Type: expand
VT1 VT2 = PMBT5551,215: Supplier: LCSC; Manufacturer: Nexperia; image: //image.lceda.cn/szlcsc/C75557.jpg; Supplier Part: C75557; SMT Type: Extend; JLCPCB SMD: Yes; Paste Type: expand
X2 = MICROXNJ: Supplier: LCSC; Supplier Part: C404969; Manufacturer: SHOU HAN; Manufacturer Part: MicroXNJ; Contributor: LCSC; Paste Type: expand
ZQ1 = HC-49S12MHZ20PF30PPM: Supplier: LCSC; Manufacturer: TAE; Manufacturer Part: HC-49S12MHz20pF30PPM; Contributor: LCSC; Supplier Part: C127674; LCSC Assembly: Yes; SMT Type: Extend; Paste Type: expand

## Nets
3v3: C7.2 C8.1 C9.1 C20.1 DA1.2(VOUT) DA1.4(VOUT) DD1.2(VDD33) DD4.15(VDDTX) DD4.19(VDDRX) DD4.20(VDDPLL) DD4.25(VDDOSC) DD4.28(VDD) L1.1 R16.2 R17.2 R25.2 R26.2 U1.2(VCCA)
5V: C17.2 C18.2 C19.1 C26.1 C27.2 C28.1 D1.1(K) D2.1(K) DA1.3(VIN) DD2.16(VCC) DD3.21(VCC) DD3.52(VCC) DD3.64(AVCC) H2.1 R20.2 R21.2 U1.19(VCCB) X3.2 X4.2
5V_EXT: D2.2(A) H2.2 X1.1 X1.2
GND: C1.2 C2.2 C3.2 C4.2 C5.2 C6.2 C7.1 C8.2 C10.1 C11.1 C14.1 C15.1 C16.1 C17.1 C18.1 C19.2 C20.2 C21.1 C22.1 C23.2 C24.1 C25.1 C26.2 C27.1 C28.2 C29.1 C30.2 C31.2 C32.2 C33.2 C34.2 DA1.1(ADJ/GND) DD1.1(GND) DD1.15(GND) DD1.38(GND) DD1.39(GND) DD2.1(GND) DD3.22(GND) DD3.53(GND) DD3.63(GND) DD4.2(VSS) DD4.11(VSSRX) DD4.18(VSSTX) DD4.21(VSSPLL) DD4.22(VSSOSC) KEY1.4 KEY2.4 KEY3.4 KEY4.1 LED1.2(K) LED2.2(K) LED3.2(K) R1.2 R4.1 R5.2 R8.1 R9.2 R12.1 R13.1 R24.1 U1.11(GND) X1.3 X1.5 X1.7 X1.9 X1.11 X1.13 X1.15 X1.17 X2.5(GND) X2.6(SH1) X2.7(SH2) X2.8(SH3) X2.9(SH4) X3.6 X4.6 X5.13 X5.15 X5.17 X5.19 X6.10 X6.11 X6.SH1 X6.SH2
AT_ADC0: DD3.61(PF0(ADC0)) X5.14
AT_ADC1: DD3.60(PF1(ADC1)) X5.16
AT_ADC2: DD3.59(PF2(ADC2))
AT_ADC3: DD3.58(PF3(ADC3))
AT_ADC4: DD3.57(PF4(ADC4/TCK))
AT_BAT1: DD3.33(PG0(WR#)) X5.1
AT_BAT2: DD3.34(PG1(RD#)) X5.2
AT_BAT3: DD3.35(PC0(A8)) X5.3
AT_BAT4: DD3.36(PC1(A9)) X5.4
AT_BAT5: DD3.37(PC2(A10)) X5.5
AT_BAT6: DD3.38(PC3(A11)) X5.6
AT_BAT7: DD3.39(PC4(A12)) X5.7
AT_BAT8: DD3.40(PC5(A13)) X5.8
AT_BAT9: DD3.41(PC6(A14)) X5.9
AT_BAT10: DD3.42(PC7(A15)) X5.10
AT_BAT11: DD3.43(PG2(ALE)) X5.11
AT_BAT12: DD3.44(PA7(AD7)) X5.12
AT_INT4: DD3.6((OC3B/INT4)PE4) KEY3.3
AT_INT5: DD3.7((OC3C/INT5)PE5) KEY4.2
AT_MISO: DD3.13((MISO)PB3) X3.1
AT_MOSI: DD3.12((MOSI)PB2) X3.4
AT_OC0: DD3.14((OC0)PB4)
AT_OC1A: DD3.15((OC1A)PB5) X5.18
AT_OC1B: DD3.16((OC1B)PB6) X5.20
AT_PD6: DD3.31((T1)PD6) R22.1
AT_PD7: DD3.32((T2)PD7) R23.1
AT_PDI: DD3.2(RXD0/(PDI)PE0) X4.4
AT_PDO: DD3.3((TXD0/PDO)PE1) X4.1
AT_RESET: C25.2 DD3.20(RESET#) R21.1 X3.5 X4.5
AT_RXD1: DD3.27((RXD1/INT2)PD2) U1.18(B2)
AT_SCK: DD3.11((SCK)PB1) X3.3 X4.3
AT_TXD1: DD3.28((TXD1/INT3)PD3) U1.20(B1)
CLKOUT: DD4.3(CLKOUT)
CS: DD1.36(IO22) DD4.9(CS#) H4.2 R26.1
DTR: DD2.13(DTR#) R14.1 VT2.2
ESP_EN: C10.2 C12.2 DD1.3(EN) KEY1.2 R16.1 VT1.3
ESP_IO0: C11.2 C13.2 DD1.25(IO0) H1.1 KEY2.2 VT2.3
ESP_IO4: DD1.26(IO4) DD4.4(INT#)
ESP_IO5: DD1.29(IO5) H4.1
ESP_IO12: DD1.14(IO12) X1.19
ESP_IO14: DD1.13(IO14) X1.20
ESP_IO18: DD1.30(IO18) H3.1
ESP_IO19: DD1.31(IO19) DD4.8(SCK)
ESP_IO21: C9.2 DD1.33(IO21) R13.2 U1.10(OE)
ESP_IO23: DD1.37(IO23) DD4.7(SI)
ESP_IO25: DD1.10(IO25) DD4.6(SO)
ESP_IO26: DD1.11(IO26) X1.16
ESP_IO27: DD1.12(IO27) X1.18
ESP_IO32: C4.1 DD1.8(IO32) R7.1 R8.2
ESP_IO33: C2.1 DD1.9(IO33) R3.1 R4.2
ESP_IO34: C5.1 DD1.6(IO34) R9.1 R10.2
ESP_IO35: C6.1 DD1.7(IO35) R11.1 R12.2
ESP_IO36: C1.1 DD1.4(SENSOR_VP) R1.1 R2.2
ESP_IO39: C3.1 DD1.5(SENSOR_VN) R5.1 R6.2
ESP_RXD0: DD1.34(RXD0) R18.2
ESP_TXD0: DD1.35(TXD0) R19.2
ESP_U2RXD: DD1.27(IO16) U1.1(A1)
ESP_U2TXD: DD1.28(IO17) U1.3(A2)
LEDA: DD4.27(LEDA) X6.9
LEDB: DD4.26(LEDB) X6.12
RESET: DD4.10(RESET#) H3.2 R25.1
RTS: DD2.14(RTS#) R15.2 VT1.2
TPIN+: DD4.13(TPIN+) R28.1 X6.3(RD+)
TPIN-: DD4.12(TPIN-) R27.2 X6.6(RD-)
TPOUT+: DD4.17(TPOUT+) R30.1 X6.1(TD+)
TPOUT-: DD4.16(TPOUT-) R29.2 X6.2(TD-)
Net-(C12-1): C12.1 KEY1.1
Net-(C13-1): C13.1 KEY2.1
Net-(C14-2): C14.2 DD2.4(V3)
Net-(C15-2): C15.2 DD2.7(XI) ZQ1.1
Net-(C16-2): C16.2 DD2.8(XO) ZQ1.2
Net-(C21-2): C21.2 KEY3.2
Net-(C22-2): C22.2 KEY4.3
Net-(C23-1): C23.1 DD3.23(XTAL2) ZQ2.2(OSC2)
Net-(C24-2): C24.2 DD3.24(XTAL1) ZQ2.1(OSC1)
Net-(C29-2): C29.2 DD3.62(AREF)
Net-(C30-1): C30.1 DD4.1(VCAP)
Net-(C31-1): C31.1 DD4.23(OSC1) ZQ3.1
Net-(C32-1): C32.1 DD4.24(OSC2) ZQ3.2
Net-(C33-1): C33.1 R27.1 R28.2 X6.5
Net-(C34-1): C34.1 L1.2 R29.1 R30.2 X6.4
Net-(D1-2): D1.2(A) X2.1(VBUS)
Net-(DD2-2): DD2.2(TXD) R19.1
Net-(DD2-3): DD2.3(RXD) R18.1
Net-(DD2-5): DD2.5(UD+) X2.3(D+)
Net-(DD2-6): DD2.6(UD-) X2.2(D-)
Net-(DD4-14): DD4.14(RBIAS) R24.2
Net-(H1-2): H1.2 R17.1
Net-(LED1-1): LED1.1(A) R20.1
Net-(LED2-1): LED2.1(A) R22.2
Net-(LED3-1): LED3.1(A) R23.2
Net-(R2-1): R2.1 X1.4
Net-(R3-2): R3.2 X1.14
Net-(R6-1): R6.1 X1.6
Net-(R7-2): R7.2 X1.12
Net-(R10-1): R10.1 X1.8
Net-(R11-2): R11.2 X1.10
Net-(R14-2): R14.2 VT1.1
Net-(R15-1): R15.1 VT2.1

Not connected (* = marked no-connect by the designer): DD1 16(IO13) 17(SD2) 18(SD3) 19(CMD) 20(CLK) 21(SD0) 22(SD1) 23(IO15) 24(IO2) 32(NC); DD2 9(CTS#) 10(DSR#) 11(RI) 12(DCD#) 15(R232); DD3 1(PEN#) 4((XCK0/AIN0)PE2) 5((OC3A/AIN1)PE3) 8((T3/INT6)PE6) 9((ICP3/INT7)PE7) 10((SS#)PB0) 17((OC2/OC1C)PB7) 18(TOSC2/PG3) 19(TOSC1/PG4) 25((SCL/INT0)PD0) 26((SDA/INT1)PD1) 29((ICP1)PD4) 30((XCK1)PD5) 45(PA6(AD6)) 46(PA5(AD5)) 47(PA4(AD4)) 48(PA3(AD3)) 49(PA2(AD2)) 50(PA1(AD1)) 51(PA0(AD0)) 54(PF7(ADC7/TDI)) 55(PF6(ADC6/TDO)) 56(PF5(ADC5/TMS)); DD4 5(NC); KEY1 3; KEY2 3; KEY3 1; KEY4 4; U1 4(A3) 5(A4) 6(A5) 7(A6) 8(A7) 9(A8) 12(B8) 13(B7) 14(B6) 15(B5) 16(B4) 17(B3); X2 4(ID); X6 7(NC) 8(CHS GND)

## Notes on the sheets
sheet 1
- Аналоговые входные сигналы
- Соединение с ESP32
- Additional
  pins
sheet 2
- Модуль ESP32
sheet 3
- Micro USB
- "Reset"
- "Boot"
sheet 4
- Перемычка на случай,
  если диод слишком
  много уронит
  напряжение
sheet 5
- Разъемы для программирования ATMEGA64
sheet 6
- Соединение с ESP32
- Ethernet RJ-45
